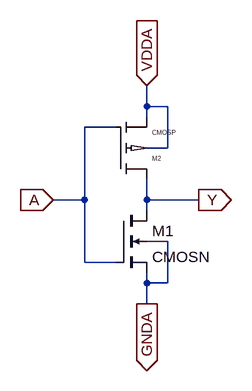
[diagram p0: schematic Not.asc]
Not.asc, the LTspice schematic file:
Version 4
SHEET 1 880 680
WIRE 192 48 192 16
WIRE 224 48 192 48
WIRE 192 64 192 48
WIRE 144 80 96 80
WIRE 224 112 224 48
WIRE 224 112 192 112
WIRE 96 192 96 80
WIRE 96 192 48 192
WIRE 192 192 192 160
WIRE 272 192 192 192
WIRE 192 208 192 192
WIRE 224 256 192 256
WIRE 96 288 96 192
WIRE 144 288 96 288
WIRE 192 320 192 304
WIRE 224 320 224 256
WIRE 224 320 192 320
WIRE 192 352 192 320
FLAG 48 192 A
IOPIN 48 192 In
FLAG 272 192 Y
IOPIN 272 192 Out
FLAG 192 16 VDDA
IOPIN 192 16 In
FLAG 192 352 GNDA
IOPIN 192 352 Out
SYMBOL cmosn 144 208 R0
SYMATTR InstName M1
SYMATTR Value2 l=180n w=1u
SYMBOL cmosp 144 160 M180
SYMATTR InstName M2
SYMATTR Value2 l=180n w=5u

The netlist it stands for:
* Not.asc
M1 Y A GNDA GNDA CMOSN l=180n w=1u
M2 Y A VDDA VDDA CMOSP l=180n w=5u
.model NMOS NMOS
.model PMOS PMOS
.lib standard.mos
.lib tsmc018.lib
.backanno
.end